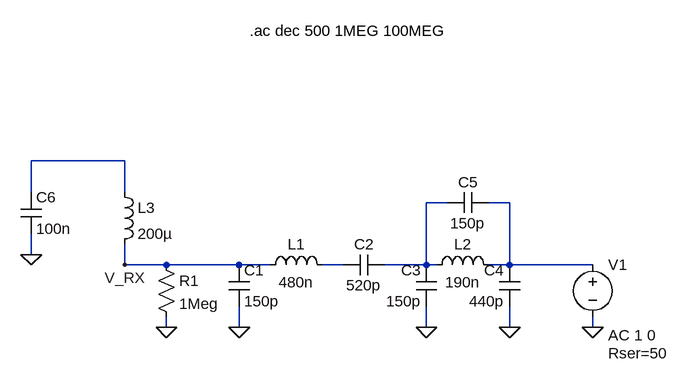
[diagram p0: schematic Class E filter RX Effect.asc]
Class E filter RX Effect.asc, the LTspice schematic file:
Version 4
SHEET 1 880 680
WIRE -96 -48 -240 -48
WIRE -240 0 -240 -48
WIRE -96 0 -96 -48
WIRE 400 16 368 16
WIRE 496 16 464 16
WIRE -240 96 -240 64
WIRE -96 112 -96 80
WIRE -32 112 -96 112
WIRE 80 112 -32 112
WIRE 128 112 80 112
WIRE 240 112 208 112
WIRE 368 112 368 16
WIRE 368 112 304 112
WIRE 384 112 368 112
WIRE 496 112 496 16
WIRE 496 112 464 112
WIRE 624 112 496 112
WIRE -32 208 -32 192
WIRE 80 208 80 176
WIRE 368 208 368 176
WIRE 496 208 496 176
WIRE 624 208 624 192
FLAG 624 208 0
FLAG 496 208 0
FLAG 368 208 0
FLAG 80 208 0
FLAG -32 208 0
FLAG -96 112 V_RX
FLAG -240 96 0
SYMBOL cap 64 112 R0
SYMATTR InstName C1
SYMATTR Value 150p
SYMBOL cap 304 96 R90
WINDOW 0 0 32 VBottom 2
WINDOW 3 32 32 VTop 2
SYMATTR InstName C2
SYMATTR Value 520p
SYMBOL cap 384 176 R180
WINDOW 0 24 56 Left 2
WINDOW 3 24 8 Left 2
SYMATTR InstName C3
SYMATTR Value 150p
SYMBOL cap 512 176 R180
WINDOW 0 24 56 Left 2
WINDOW 3 24 8 Left 2
SYMATTR InstName C4
SYMATTR Value 440p
SYMBOL cap 400 32 R270
WINDOW 0 32 32 VTop 2
WINDOW 3 0 32 VBottom 2
SYMATTR InstName C5
SYMATTR Value 150p
SYMBOL ind 112 128 R270
WINDOW 0 32 56 VTop 2
WINDOW 3 5 56 VBottom 2
SYMATTR InstName L1
SYMATTR Value 480n
SYMBOL ind 368 128 R270
WINDOW 0 32 56 VTop 2
WINDOW 3 5 56 VBottom 2
SYMATTR InstName L2
SYMATTR Value 190n
SYMBOL voltage 624 96 R0
WINDOW 123 24 124 Left 2
WINDOW 39 24 152 Left 2
SYMATTR Value2 AC 1 0
SYMATTR SpiceLine Rser=50
SYMATTR InstName V1
SYMATTR Value ""
SYMBOL res -48 96 R0
SYMATTR InstName R1
SYMATTR Value 1Meg
SYMBOL ind -112 -16 R0
SYMATTR InstName L3
SYMATTR Value 200µ
SYMBOL cap -256 0 R0
SYMATTR InstName C6
SYMATTR Value 100n
TEXT 96 -248 Left 2 !.ac dec 500 1MEG 100MEG

The netlist it stands for:
* Class E filter RX Effect.asc
C1 V_RX 0 150p
C2 N002 N004 520p
C3 0 N002 150p
C4 0 N003 440p
C5 N002 N003 150p
L1 V_RX N004 480n
L2 N002 N003 190n
V1 N003 0 AC 1 0 Rser=50
R1 V_RX 0 1Meg
L3 N001 V_RX 200µ
C6 N001 0 100n
.ac dec 500 1MEG 100MEG
.backanno
.end